# EAGLE design DC_RF_ADDER_single_channel (EAGLE 6.5.0)
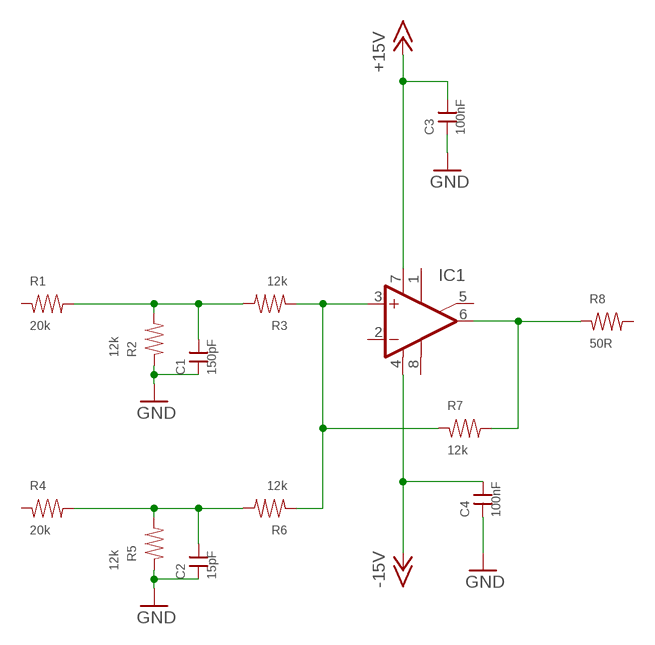
[diagram p0: schematic, sheet 1]

## Parts
C1  150pF  CAP0603  [0603]
C2  15pF  CAP0603  [0603]
C3  100nF  CAP0603  [0603]
C4  100nF  CAP0603  [0603]
IC1  OPAMP-SO  [SO08]
R1  20k  RES0603  [0603]
R2  12k  RES0603  [0603]
R3  12k  RES0603  [0603]
R4  20k  RES0603  [0603]
R5  12k  RES0603  [0603]
R6  12k  RES0603  [0603]
R7  12k  RES0603  [0603]
R8  50R  RES0603  [0603]

## Nets
+15V: C3.2 IC1.7(V+)
-15V: C4.2 IC1.4(V-)
GND: C1.1 C2.1 C3.1 C4.1 R2.1 R5.1
N$1: C1.2 R1.2 R2.2 R3.2
N$2: C2.2 R4.2 R5.2 R6.2
N$3: IC1.3(+IN) R3.1 R6.1 R7.1
N$4: IC1.6(OUT) R7.2 R8.1
Unconnected: IC1.1(ON1) IC1.2(-IN) IC1.5(ON2) IC1.8(OPT) R1.1 R4.1 R8.2

## Library data of the parts
C1-C4 = rlc-jqi:CAP: SMT Capacitor
IC1 = opamp-jqi:OPAMP: Basic Op Amp. Be sure to check actual pinout of your device, and modify as necessary!
R1-R8 = rlc-jqi:RES: SMT Resistor

## Board
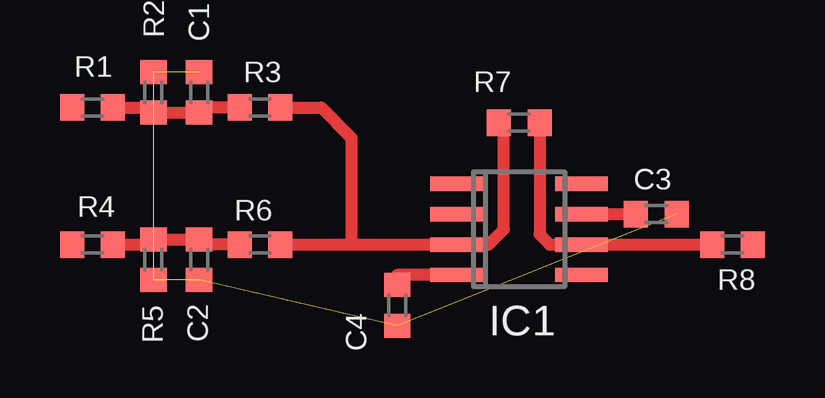
[diagram p1: board, top side]

No outline drawn. Coordinates in mm, seen from the top.
Copper layers (1*16): Top 0.035mm / dielectric 1.5mm / Bottom 0.035mm
Design rules "default": minimum track width 10mil, minimum drill 24mil, track to track 8mil, track to pad 8mil, pad to pad 8mil, via to via 8mil, smd to smd 8mil, copper to edge 40mil, drill to drill 8mil, minimum pad ring 10mil, minimum via ring 8mil, stop-mask expansion 4mil, vias tented up to drill 0mil, thermal gap 10mil

### Footprints (pad centres in the part's own frame; a part is rotated, then mirrored left to right if it is on the bottom)
0603 = smd 1 x 1.1: 1 -0.85,0; 2 0.85,0
SO08 = smd 2.2 x 0.6: 1 -2.6,1.27; 2 -2.6,0; 3 -2.6,-1.27; 4 -2.6,-2.54; 5 2.6,-2.54; 6 2.6,-1.27; 7 2.6,0; 8 2.6,1.27

### Placement (x,y rotation side)
C1  -10.79,3.81 270 top
C2  -10.79,-3.17 90 top
C3  8.26,-1.27 180 top
C4  -2.54,-5.08 90 top
IC1  2.54,-1.27 0 top
R1  -15.24,3.17 0 top
R2  -12.7,3.81 270 top
R3  -8.26,3.17 180 top
R4  -15.24,-2.54 0 top
R5  -12.7,-3.17 90 top
R6  -8.26,-2.54 180 top
R7  2.54,2.54 0 top
R8  11.43,-2.54 0 top

### Tracks (layer width: path | path; a pad name or v marks a point on that pad's centre or on a via)
+15V
  Top 0.508: IC1.7 C3.2
-15V
  Top 0.508: IC1.4 -2.54,-3.81 C4.2
GND  (5 unrouted)
N$1
  Top 0.508: R1.2 -12.91,3.17 R2.2 C1.2 -10.58,3.17 R3.2
N$2
  Top 0.508: R4.2 -12.91,-2.54 R5.2 C2.2 -10.58,-2.54 R6.2
N$3
  Top 0.508: R7.1 1.91,2.33 1.91,-1.91 1.27,-2.54 IC1.3 -4.45,-2.54 | R6.1 -4.45,-2.54 | R3.1 -5.71,3.17 -4.45,1.91 -4.45,-2.54
N$4
  Top 0.508: R8.1 IC1.6 3.81,-2.54 3.39,-2.12 R7.2